# EasyEDA Pro project 测试用途.eprj, schematic Schematic2_1
Board Name: 2S充电电路_支持显示; Create Date: 2025-10-02; Page Name: P1; Project Name: 测试用途; Schematic Name: Schematic2_1; Update Date: 2025-10-05; Company: 嘉立创EDA; Page Size: A4; Version: V1.0
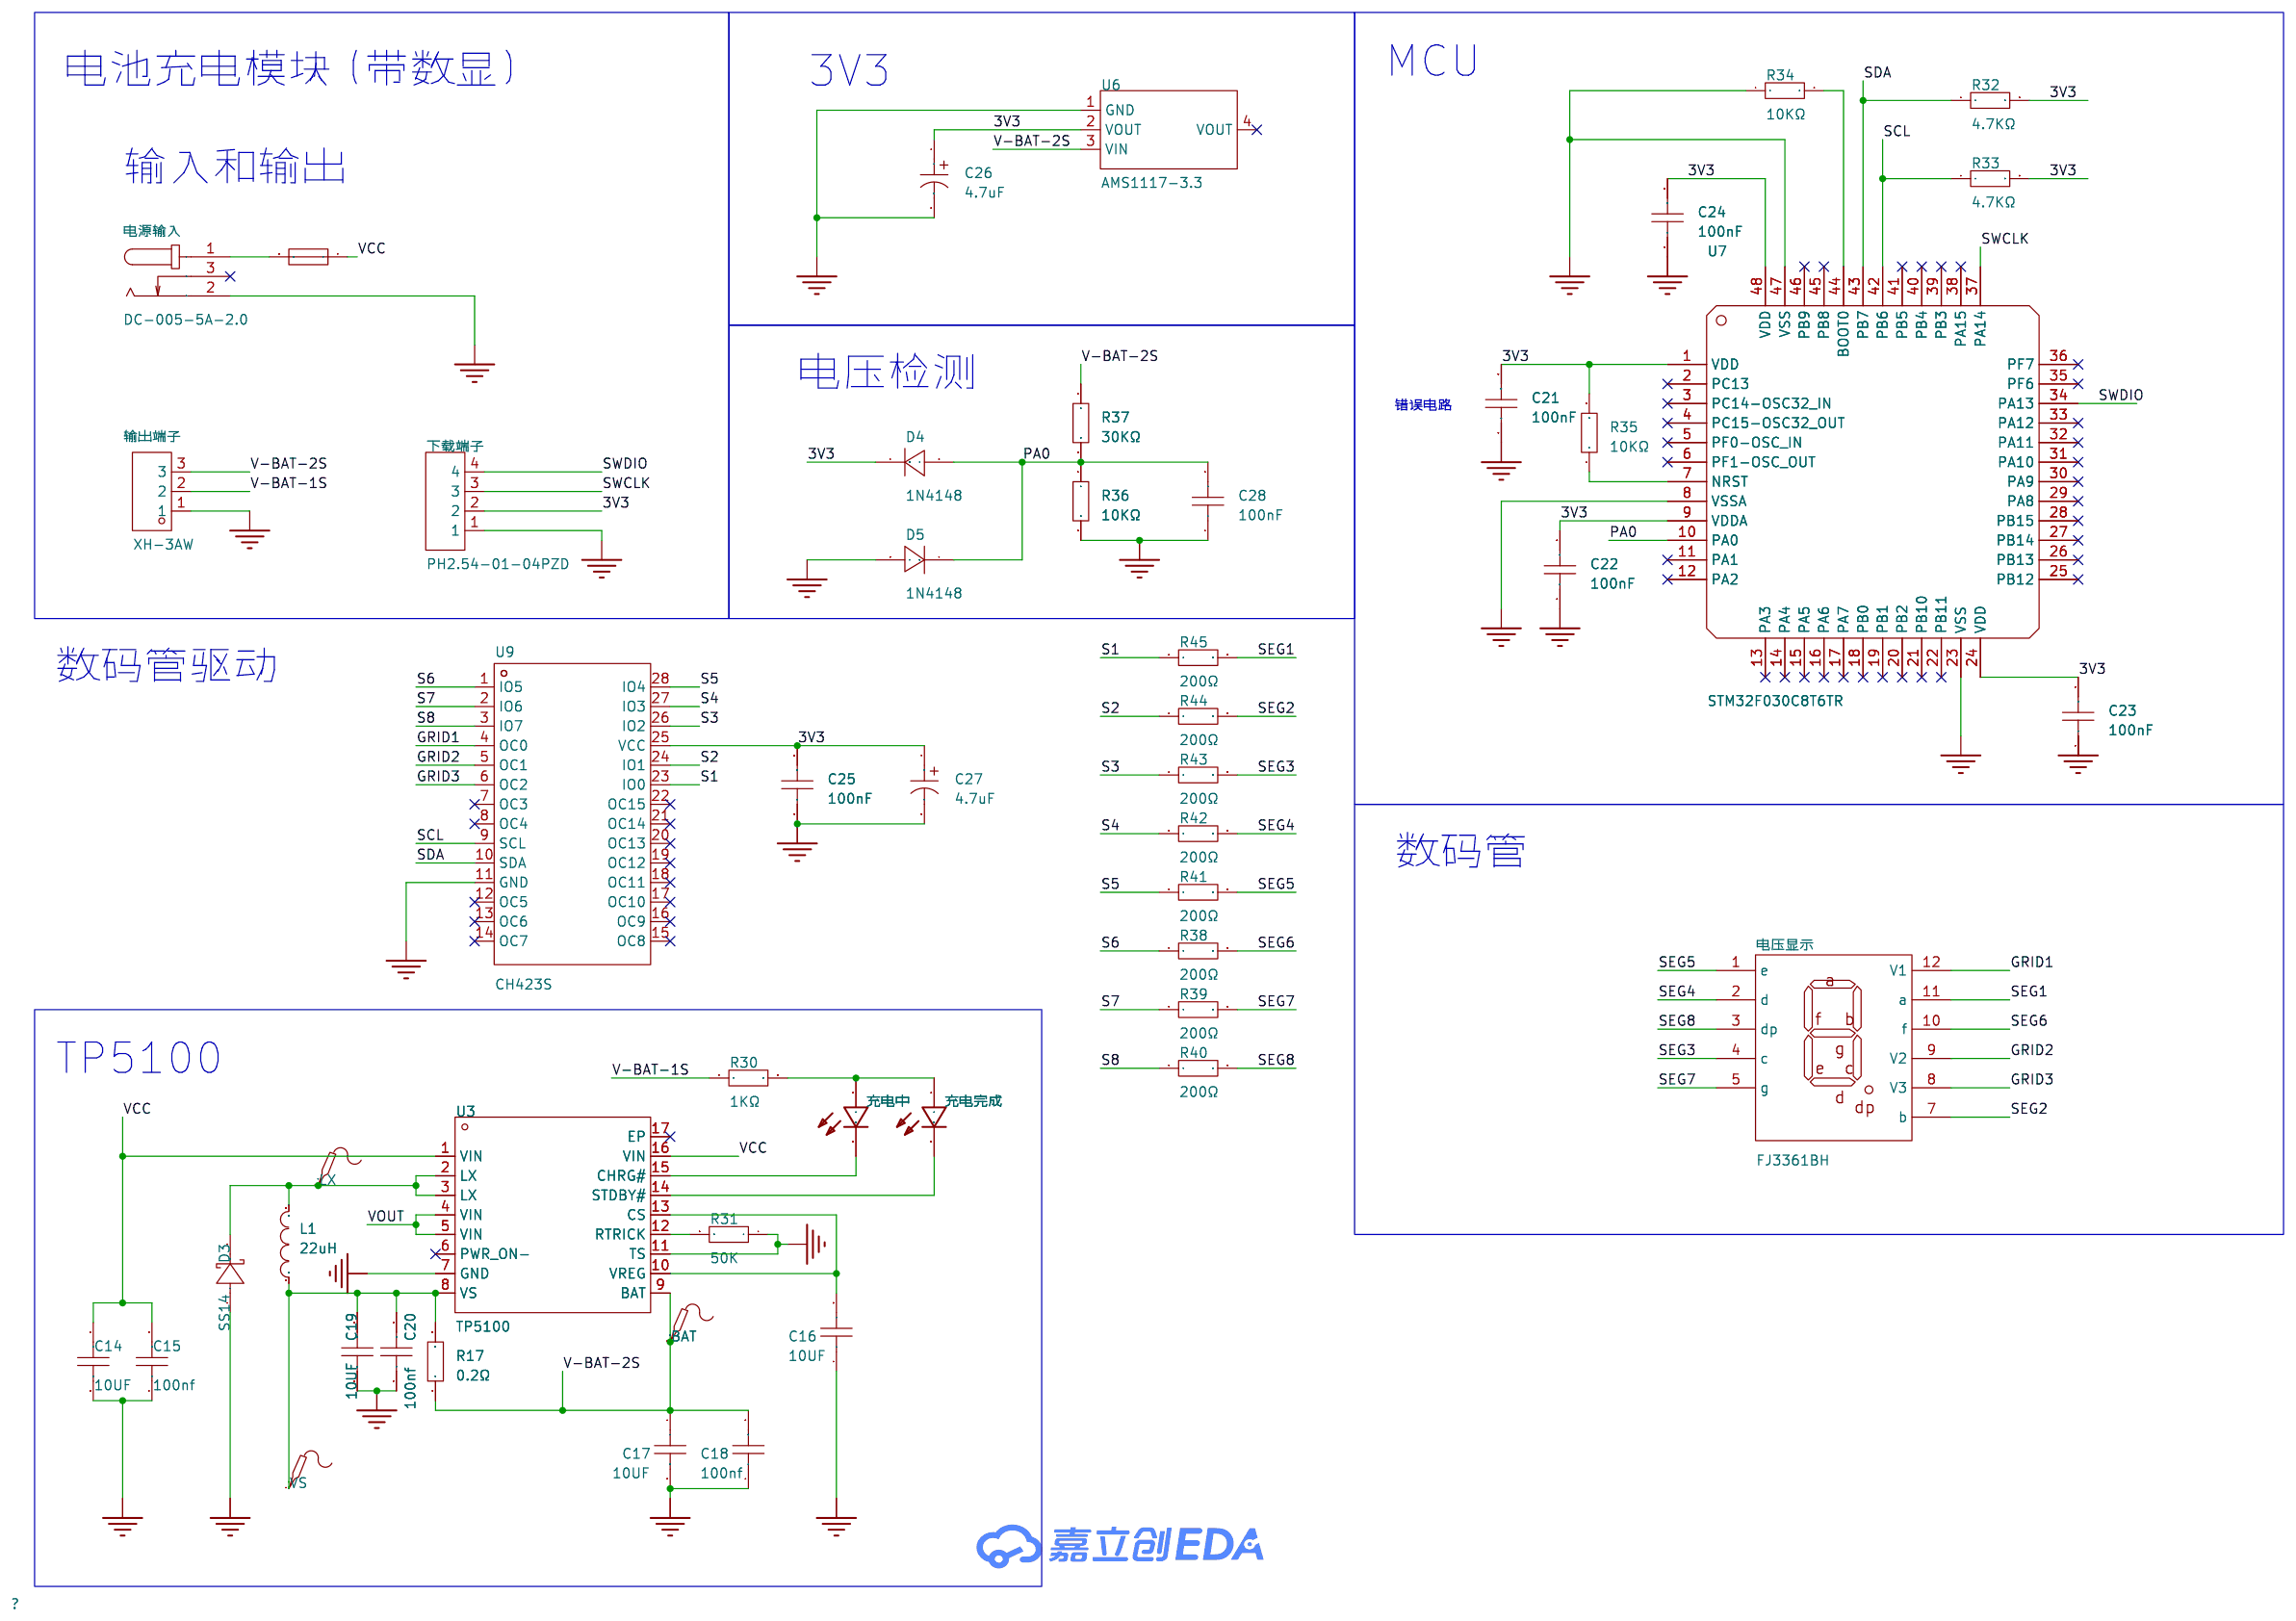
[diagram p3: schematic sheet]

## Parts
BAT  -  [Test-Point-0.5mm]
C14  10UF  [C1210]
C15  100nf  [C1206]
C16  10UF  [C1206]
C17  10UF  [C1210]
C18  100nf  [C1206]
C19  10UF  [C1210]
C20  100nf  [C1206]
C21  100nF  [C0603]
C22  100nF  [C0603]
C23  100nF  [C0603]
C24  100nF  [C0603]
C25  100nF  [C0603]
C26  4.7uF  [CAP-TH_BD4.0-P1.50-D0.5-FD]
C27  4.7uF  [CAP-TH_BD4.0-P1.50-D0.5-FD]
C28  100nF  [C0603]
D3  SS14  [SMA_L4.3-W2.6-LS5.0-FD]
D4  1N4148  [DO-35_BD2.0-L4.2-P8.20-D0.5-RD]
D5  1N4148  [DO-35_BD2.0-L4.2-P8.20-D0.5-RD]
F1  SMD1206  [F1206]
L1  22uH  [IND-SMD_L12.0-W12.0_YPRH120X]
LX  -  [Test-Point-0.5mm]
R17  0.2Ω  [R1206]
R30  1KΩ  [R1206]
R31  50K  [R1206]
R32  4.7KΩ  [R0603]
R33  4.7KΩ  [R0603]
R34  10KΩ  [R0603]
R35  10KΩ  [R0603]
R36  10KΩ  [R0603]
R37  30KΩ  [R0603]
R38  200Ω  [R0603]
R39  200Ω  [R0603]
R40  200Ω  [R0603]
R41  200Ω  [R0603]
R42  200Ω  [R0603]
R43  200Ω  [R0603]
R44  200Ω  [R0603]
R45  200Ω  [R0603]
U3  TP5100  [TQFN-16_L4.0-W4.0-P0.65-BL-EP]
U6  AMS1117-3.3  [SOT-223-3_L6.5-W3.4-P2.30-LS7.0-BR]
U7  STM32F030C8T6TR  [LQFP-48_L7.0-W7.0-P0.50-LS9.0-BL]
U9  CH423S  [SOP-28_L17.9-W7.5-P1.27-LS10.3-BL]
VS  -  [Test-Point-0.5mm]
下载端子  PH2.54-01-04PZD  [HDR-TH_4P-P2.54-V-M-1]
充电中  19-217/BHC-ZL1M2RY/3T  [LED0603-R-RD]
充电完成  19-217/BHC-ZL1M2RY/3T  [LED0603-R-RD]
电压显示  FJ3361BH  [LED-SEG-TH_10P-L22.5-W14.0-P2.54-S10.16-BL]
电源输入  DC-005-5A-2.0  [DC-IN-TH_DC-005-5A-2.0]
输出端子  XH-3AW  [CONN-TH_3P-P2.54_HCTL_XH-3AW]

## Library data of the parts
BAT LX VS = Test-Point: Test Point 测试点
C14 C17 C19 = HGC1210R5476M250NSVK: 容值:47uF;精度:±20%;额定电压:25V;温度系数:X5R;; LCSC Part Name: 47uF ±20% 25V; Supplier Part: C7432791; Manufacturer: Chinocera(华瓷); Supplier Footprint: 1210; JLCPCB Part Class: 扩展库; Datasheet: https://atta.szlcsc.com/upload/public/pdf/source/20240320/FAC3FEC40A78BC5CCCE96C232A94D860.pdf; Supplier: LCSC; Tolerance: ±20%; Voltage Rating: 25V; Temperature Coefficient: X5R
C15 C16 C18 C20 = HGC1206R5106K500NSPJ: 容值:10uF;精度:±10%;额定电压:50V;温度系数:X5R;; LCSC Part Name: 10uF ±10% 50V; Supplier Part: C7432781; Manufacturer: Chinocera(华瓷); Supplier Footprint: 1206; JLCPCB Part Class: 扩展库; Datasheet: https://atta.szlcsc.com/upload/public/pdf/source/20240320/FAC3FEC40A78BC5CCCE96C232A94D860.pdf; Supplier: LCSC; Tolerance: ±10%; Voltage Rating: 50V; Temperature Coefficient: X5R
C21-C25 C28 = CGA0603X7R104K500JT: LCSC Part Name: 100nF ±10% 50V; Supplier Part: C6119867; Manufacturer: HRE(芯声); Supplier Footprint: 0603; JLCPCB Part Class: 扩展库; Datasheet: https://atta.szlcsc.com/upload/public/pdf/source/20250103/C44077DA9E7B3EFAE02F22B6D3D1CBC9.pdf; Supplier: LCSC; Tolerance: ±10%; Voltage Rating: 50V; Temperature Coefficient: X7R
C26 C27 = KM1H4R7M0405: LCSC Part Name: 4.7uF ±20% 50V; Supplier Part: C2873979; Manufacturer: ROQANG(容强); Supplier Footprint: 插件,D4xL5mm; JLCPCB Part Class: 扩展库; Datasheet: https://item.szlcsc.com/datasheet/KM1H4R7M0405/3078462.html; Supplier: LCSC; Tolerance: ±20%; Voltage Rating: 50V; Ripple Current: 16mA@120kHz; Diameter: 4mm; Height - Seated (Max): 5mm; Lifetime: 2000hrs@105℃; Operating Temperature: -40℃~+105℃
D3 = SS14_C7420316: 二极管配置:独立式;正向压降(Vf):550mV@1.0A;直流反向耐压(Vr):40V;整流电流:1A;; LCSC Part Name: 电压:40V 电流:1A; Supplier Part: C7420316; Manufacturer: 宏迦橙; Supplier Footprint: SMA(DO-214AC); JLCPCB Part Class: 扩展库; Datasheet: https://atta.szlcsc.com/upload/public/pdf/source/20230828/C73881E3299A0827586C2B1C18B17A53.pdf; Supplier: LCSC; Diode Configuration: 独立式; Forward Voltage (Vf@If): 550mV@1.0A; Reverse Voltage (Vr): 40V; Rectified Current: 1A; Reverse Leakage Current (Ir): 200uA@40V
D4 D5 = 1N4148_C402212: Supplier Part: C402212; Manufacturer: LGE(鲁光); Supplier Footprint: DO-35; JLCPCB Part Class: 扩展库; Datasheet: https://item.szlcsc.com/datasheet/1N4148/387357.html; Supplier: LCSC; Voltage - Forward(Vf@If): 1V@10mA; Voltage - DC Reverse(Vr): 75V; Current - Rectified: 150mA; Pd - Power Dissipation: 500mW; Reverse Leakage Current (Ir): 5uA@75V; Reverse Recovery Time (trr): 4ns; Non-Repetitive Peak Forward Surge Current: 2A
F1 = SMD1206-150-16: 耐压(Vmax):16V;最大电流(Imax):40A;保持电流(Ihold):1.5A;跳闸电流(Itrip):3A;; Supplier Part: C46641031; Manufacturer: 宏嘉诚; Supplier Footprint: 1206; JLCPCB Part Class: 扩展库; Datasheet: https://atta.szlcsc.com/upload/public/pdf/source/20250414/5AC46D2F961B725C9DB708C91B04DBEC.pdf; Supplier: LCSC; Voltage - Max: 16V; Current - Max: 40A; Hold Current: 1.5A; Trip Current: 3A; Power Dissipation: 1W; Resistance - Initial (Ri) (Min): 25mΩ; Resistance - Post Trip (R1) (Max): 130mΩ; Time to Trip(Max): 300ms
L1 = YPRH1207-220M: 电感值:22uH;精度:±20%;额定电流:3.6A;; LCSC Part Name: 22uH ±20%; Supplier Part: C339950; Manufacturer: YJYCOIN(益嘉源); Supplier Footprint: SMD,12x12mm; JLCPCB Part Class: 扩展库; Datasheet: https://atta.szlcsc.com/upload/public/pdf/source/20200623/C339950_CB2CAFE108BC5DE837AA8F39C29DA454.pdf; Supplier: LCSC; Tolerance: ±20%; Rated Current: 3.6A; DC Resistance (DCR): 43mΩ
R17 R30 R31 = 1206W4F1002T5E: 电阻类型:厚膜电阻;阻值:10kΩ;精度:±1%;功率:250mW;最大工作电压:200V;温度系数:±100ppm/℃;; LCSC Part Name: 10kΩ ±1% 250mW 厚膜电阻; Supplier Part: C17902; Manufacturer: UNI-ROYAL(厚声); Supplier Footprint: 1206; JLCPCB Part Class: 基础库; Datasheet: https://atta.szlcsc.com/upload/public/pdf/source/20200306/C422600_1E6D84923E4A46A82E41ADD87F860B5C.pdf; Supplier: LCSC; Type: 厚膜电阻; Tolerance: ±1%; Power(Watts): 250mW; Overload Voltage (Max): 200V; Temperature Coefficient: ±100ppm/℃; Operating Temperature Range: -55℃~+155℃
R32-R45 = 0603WAF1002T5E: 电阻类型:厚膜电阻;阻值:10kΩ;精度:±1%;功率:100mW;工作电压:75V;温度系数:±100ppm/℃;; LCSC Part Name: 厚膜电阻 10kΩ ±1% 100mW; Supplier Part: C25804; Manufacturer: UNI-ROYAL(厚声); Supplier Footprint: 0603; JLCPCB Part Class: 基础库; Datasheet: https://atta.szlcsc.com/upload/public/pdf/source/20200306/C422600_1E6D84923E4A46A82E41ADD87F860B5C.pdf; Supplier: LCSC; Type: 厚膜电阻; Tolerance: ±1%; Power(Watts): 100mW; Voltage-Supply(Max): 75V; Temperature Coefficient: ±100ppm/℃; Operating Temperature: -55℃~+155℃
U3 = TP5100: Supplier Part: C379389; Manufacturer: TOPPOWER(南京拓微); Supplier Footprint: TQFN-16-EP(4x4); JLCPCB Part Class: 扩展库; Datasheet: https://atta.szlcsc.com/upload/public/pdf/source/20230625/310531CA6E48A76C009AF7A61C581768.pdf; Supplier: LCSC
U6 = AMS1117-3.3_C6186: LCSC Part Name: 输出3.3V 1A; Supplier Part: C6186; Manufacturer: AMS; Supplier Footprint: SOT-223; JLCPCB Part Class: 基础库; Datasheet: https://item.szlcsc.com/datasheet/AMS1117-3.3/6652.html; Supplier: LCSC; Output Type: 固定; Voltage - Supply: 16V; Output Voltage: 3.3V; Output Current: 1A; Power Supply Rejection Ratio (PSRR): 72dB@(120Hz); Voltage Dropout: 1.1V@(800mA); standby current: 5mA; Features: 过流保护；过热保护; Operating Temperature: -40℃~+125℃; Output Configuration: 正极; Number of Outputs: 1
U7 = STM32F030C8T6TR: LCSC Part Name: 主流ARM Cortex-M0超值系列MCU，具有64 KB Flash和48 MHz CPU; Supplier Part: C40053; Manufacturer: ST(意法半导体); Supplier Footprint: LQFP-48(7x7); JLCPCB Part Class: 扩展库; Datasheet: https://atta.szlcsc.com/upload/public/pdf/source/20151012/1457707443333.pdf; Supplier: LCSC; CPU Core: ARM-M0; CPU Maximum Speed: 48MHz; Program Storage Size: 64KB; Program Memory Type: FLASH; Number of I/O: 39; ADC (Bit): 12bit; Voltage - Supply: 2.4V~3.6V
U9 = CH423S: LCSC Part Name: 两线远程 I/O扩展芯片; Supplier Part: C111663; Manufacturer: WCH(南京沁恒); Supplier Footprint: SOP-28-300mil; JLCPCB Part Class: 扩展库; Datasheet: https://item.szlcsc.com/datasheet/CH423S/112891.html; Supplier: LCSC; Number of I/O: 8; Voltage - Supply: 3V~5V; Clock Frequency: 1MHz; Operating Temperature: -40℃~+85℃
下载端子 = PH2.54-01-04PZD: LCSC Part Name: 1x4P 间距:2.54mm 方针 直插; Supplier Part: C7501582; Manufacturer: XUNPU(讯普); Supplier Footprint: 插件,P=2.54mm; JLCPCB Part Class: 扩展库; Datasheet: https://item.szlcsc.com/datasheet/PH2.54-01-04PZD/8584136.html; Supplier: LCSC; Pin Structure: 1x4P; Pitch: 2.54mm; Circluar Pins/Square Pins: 方针; Mounting Type: 直插; Number of Rows: 单排; Number of Pins: 4P; Length of Mating Pin: 6mm; Insulation Height: 2.5mm; Length of End Connection Pin: 3mm; Contact Material: 黄铜; Operating Temperature: -40℃~+105℃; Color: 黑色
充电中 充电完成 = 19-217/BHC-ZL1M2RY/3T: Supplier: LCSC; Manufacturer: EVERLIGHT; image: //image.lceda.cn/szlcsc/C72041.jpg; Supplier Part: C72041; JLCPCB Part Class: Basic; spicePre: L
电压显示 = FJ3361BH: LCSC Part Name: 3位0.36英寸红色数码管 共阳极; Supplier Part: C10705; Manufacturer: 志浩; Supplier Footprint: 插件; JLCPCB Part Class: 扩展库; Datasheet: https://item.szlcsc.com/datasheet/FJ3361BH/11249.html; Supplier: LCSC; Number of Characters: 3位; Digit/Alpha Size(inch): 0.36; Illumination Color: 红色; LED Polarity: 共阳极
电源输入 = DC-005-5A-2.0: 连接器类型:DC电源插座;安装方式:弯插;触点内径:2mm;触点外径:6.2mm;额定电流:5A;额定电压:24V;工作温度范围:-20℃~+70℃;; LCSC Part Name: DC电源插座 内径:2mm 外径:6.2mm; Supplier Part: C381116; Manufacturer: XKB Connection(中国星坤); Supplier Footprint: 插件; JLCPCB Part Class: 扩展库; Datasheet: https://atta.szlcsc.com/upload/public/pdf/source/20211015/707A35F7AB6E89C57AAB641950105BB7.pdf; Supplier: LCSC; Connector Type: DC电源插座; Mounting Style: 弯插; Inside Contact Diameter: 2mm; Outside Contact Diameter: 6.2mm; Current Rating (Max): 5A; Voltage Rating (Max): 24V; Operating Temperature Range: -20℃~+70℃
输出端子 = XH-3AW_C2908612: 插针结构:1x3P;间距:2.54mm;安装方式:弯插;参考系列:XH;总PIN数:3P;排数:1;每排PIN数:3;行距:-;额定电流:3A;触头材质:黄铜;触头镀层:锡;工作温度范围:-25℃~+85℃;; LCSC Part Name: 1x3P 间距:2.54mm 弯插 系列:XH; Supplier Part: C2908612; Manufacturer: HCTL(华灿天禄); Supplier Footprint: 弯插,P=2.5mm; JLCPCB Part Class: 扩展库; Datasheet: https://atta.szlcsc.com/upload/public/pdf/source/20230711/B565BAF3B11666EF6B81B3605408F2BD.pdf; Supplier: LCSC; Pins Structure: 1x3P; Pitch: 2.54mm; Mounting Style: 弯插; Reference Series: XH; Number of Pins: 3P; Number of Rows: 1; Number of PINs Per Row: 3; Current Rating (Max): 3A; Contact Material: 黄铜; Contact Plating: 锡; Operating Temperature Range: -25℃~+85℃

## Nets
3V3: C21.2 C22.2 C23.2 C24.2 C25.2 C26.1 C27.1 D4.1(C) R32.2 R33.2 R35.2 U6.2(VOUT) U7.1(VDD) U7.9(VDDA) U7.24(VDD) U7.48(VDD) U9.25(VCC) 下载端子.2
GND: C14.2 C15.1 C16.1 C17.2 C18.1 C19.2 C20.1 C21.1 C22.1 C23.1 C24.1 C25.1 C26.2 C27.2 C28.1 D3.1(A) D5.2(A) R31.1 R34.1 R36.2 U3.7(GND) U3.11(TS) U6.1(GND) U7.8(VSSA) U7.23(VSS) U7.47(VSS) U9.11(GND) 下载端子.1 电源输入.2 输出端子.1
VCC: C14.1 C15.2 F1.1 U3.1(VIN) U3.16(VIN)
GRID1: U9.4(OC0) 电压显示.12(V1)
GRID2: U9.5(OC1) 电压显示.9(V2)
GRID3: U9.6(OC2) 电压显示.8(V3)
PA0: C28.2 D4.2(A) D5.1(C) R36.1 R37.2 U7.10(PA0)
S1: R45.1 U9.23(IO0)
S2: R44.1 U9.24(IO1)
S3: R43.1 U9.26(IO2)
S4: R42.1 U9.27(IO3)
S5: R41.1 U9.28(IO4)
S6: R38.1 U9.1(IO5)
S7: R39.1 U9.2(IO6)
S8: R40.1 U9.3(IO7)
SCL: R33.1 U7.42(PB6) U9.9(SCL)
SDA: R32.1 U7.43(PB7) U9.10(SDA)
SEG1: R45.2 电压显示.11(a)
SEG2: R44.2 电压显示.7(b)
SEG3: R43.2 电压显示.4(c)
SEG4: R42.2 电压显示.2(d)
SEG5: R41.2 电压显示.1(e)
SEG6: R38.2 电压显示.10(f)
SEG7: R39.2 电压显示.5(g)
SEG8: R40.2 电压显示.3(dp)
SWCLK: U7.37(PA14) 下载端子.3
SWDIO: U7.34(PA13) 下载端子.4
V-BAT-1S: R30.1 输出端子.2
V-BAT-2S: BAT.1 C17.1 C18.2 R17.1 R37.1 U3.9(BAT) U6.3(VIN) 输出端子.3
VOUT: U3.4(VIN) U3.5(VIN)
$1N690: U3.15(CHRG#) 充电中.2(C)
$1N694: D3.2(K) L1.2 LX.1 U3.2(LX) U3.3(LX)
$1N699: C16.2 U3.10(VREG) U3.13(CS)
$1N702: C19.1 C20.2 L1.1 R17.2 U3.8(VS) VS.1
$1N706: U3.14(STDBY#) 充电完成.2(C)
$1N708: R30.2 充电中.1(A) 充电完成.1(A)
$1N712: R31.2 U3.12(RTRICK)
$1N1690: F1.2 电源输入.1
$1N9817: R34.2 U7.44(BOOT0)
$1N9875: R35.1 U7.7(NRST)

Not connected (* = marked no-connect by the designer): U3 6(PWR_ON-)* 17(EP)*; U6 4(VOUT)*; U7 2(PC13)* 3(PC14-OSC32_IN)* 4(PC15-OSC32_OUT)* 5(PF0-OSC_IN)* 6(PF1-OSC_OUT)* 11(PA1)* 12(PA2)* 13(PA3)* 14(PA4)* 15(PA5)* 16(PA6)* 17(PA7)* 18(PB0)* 19(PB1)* 20(PB2)* 21(PB10)* 22(PB11)* 25(PB12)* 26(PB13)* 27(PB14)* 28(PB15)* 29(PA8)* 30(PA9)* 31(PA10)* 32(PA11)* 33(PA12)* 35(PF6)* 36(PF7)* 38(PA15)* 39(PB3)* 40(PB4)* 41(PB5)* 45(PB8)* 46(PB9)*; U9 7(OC3)* 8(OC4)* 12(OC5)* 13(OC6)* 14(OC7)* 15(OC8)* 16(OC9)* 17(OC10)* 18(OC11)* 19(OC12)* 20(OC13)* 21(OC14)* 22(OC15)*; 电源输入 3*

## Notes on the sheet
- 电池充电模块（带数显）
- 3V3
- MCU
- 输入和输出
- 电压检测
- 错误电路
- 数码管驱动
- 数码管
- TP5100
